# Altium project Remote_Controller.PrjPcb
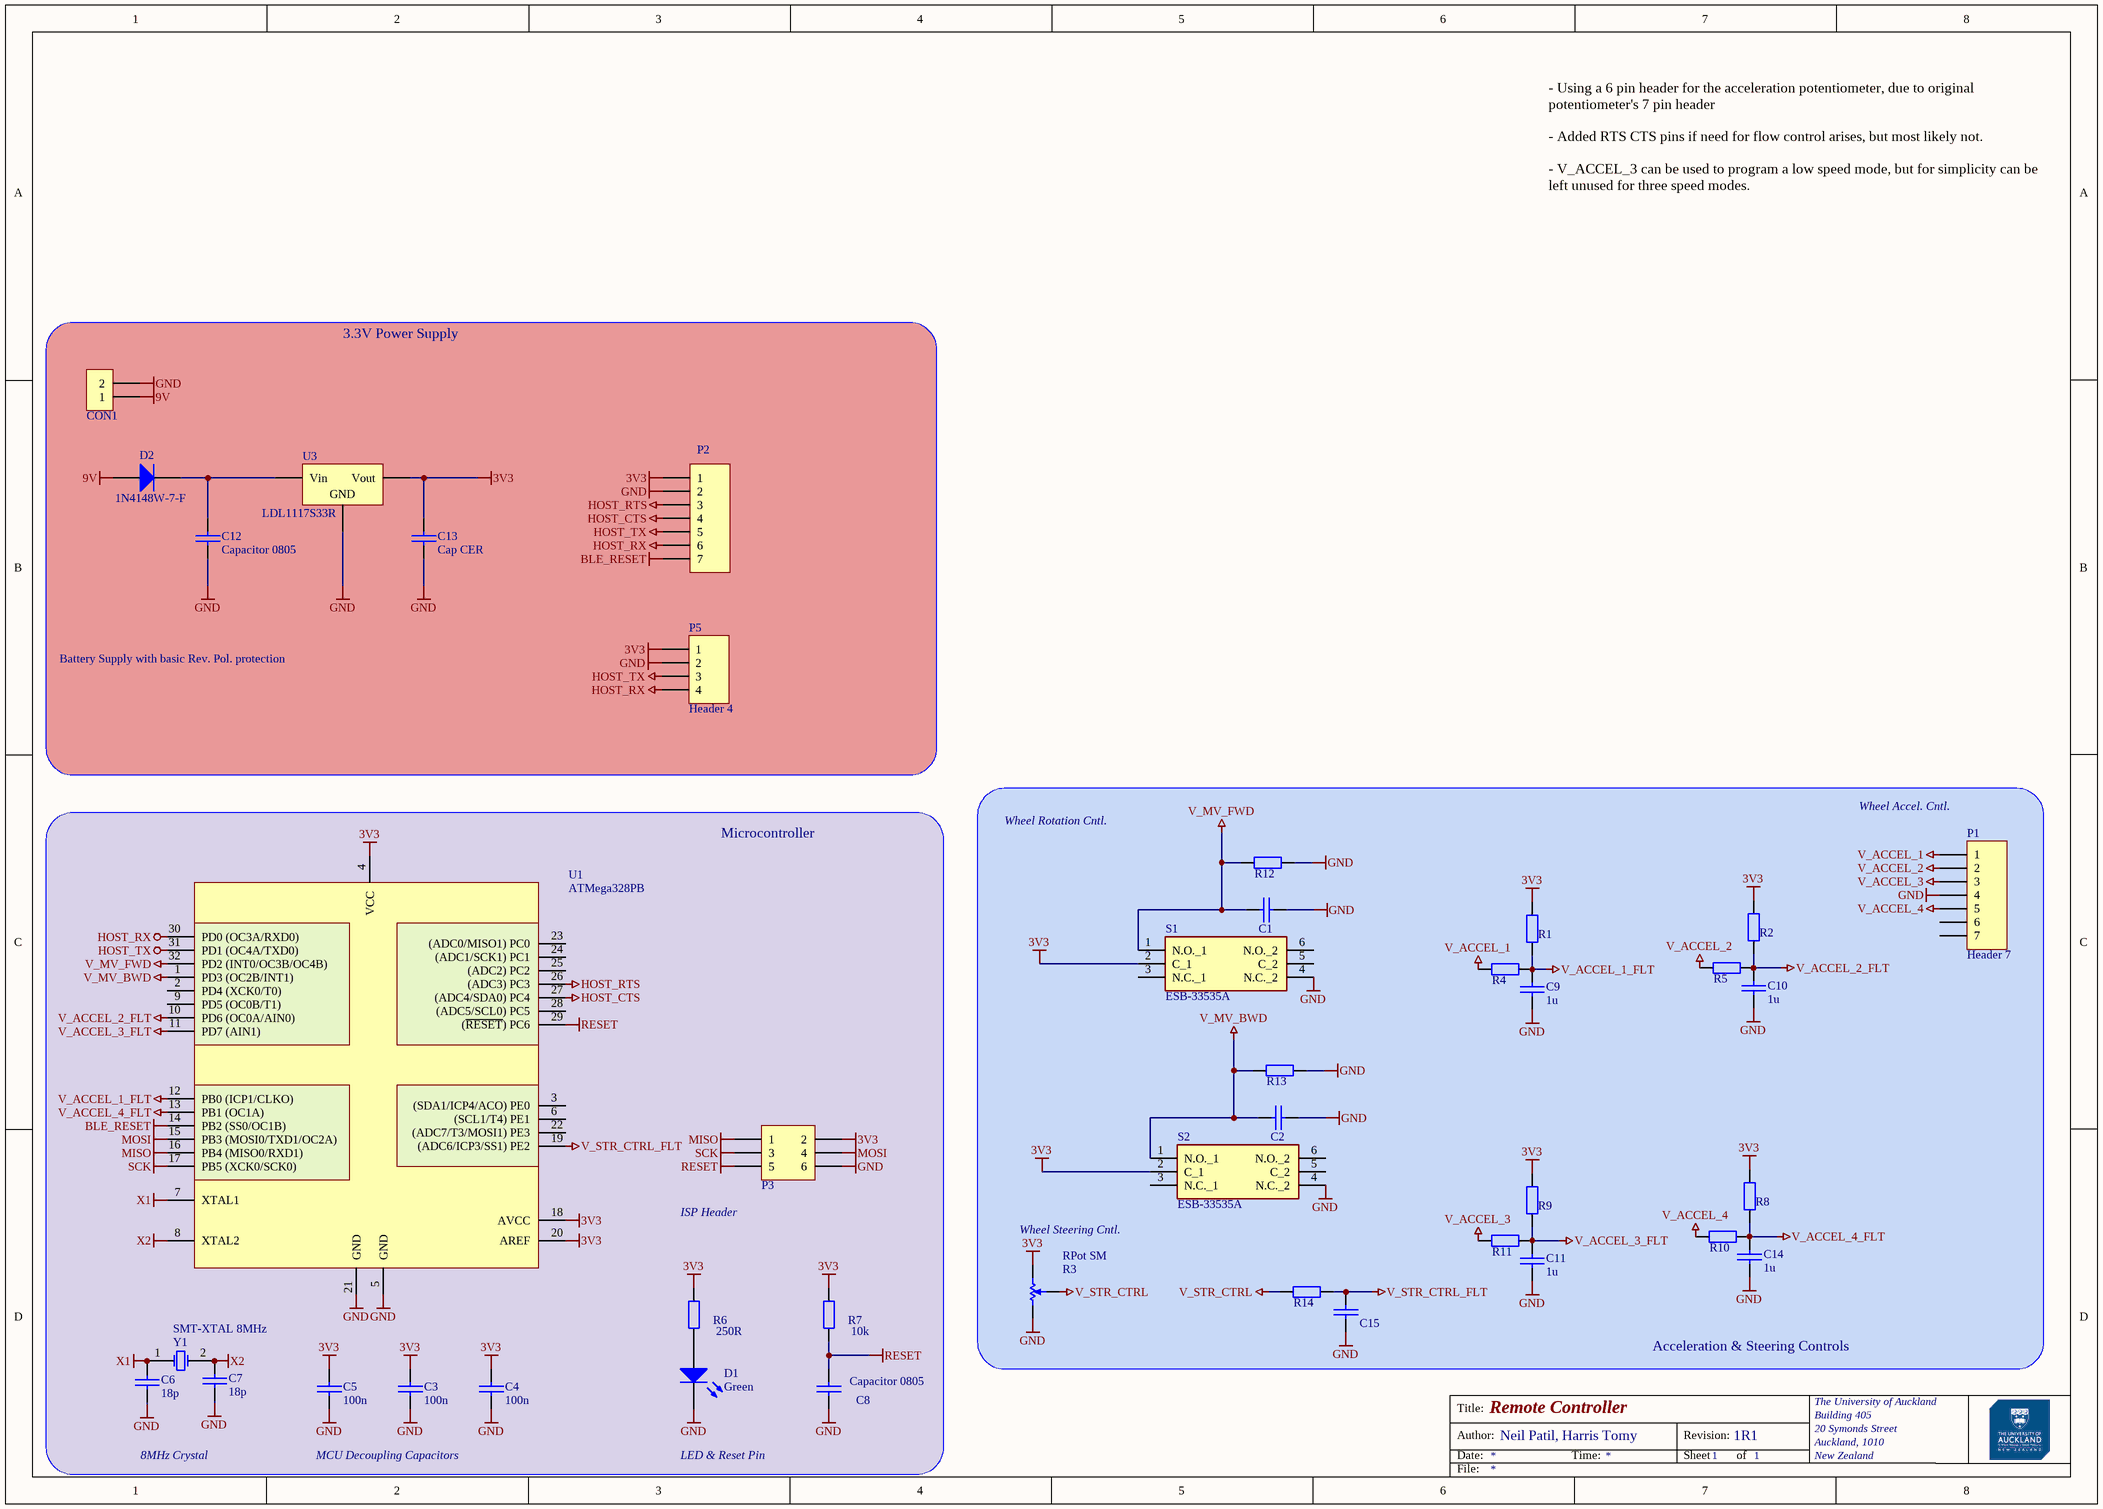
[diagram p0: RemoteSch_1R1.SchDoc]
1 sheet, 41 parts. Net scope: global (net labels, ports and power ports of the same name join across sheets).
Board file: RemoteCntrl_1R3.PcbDoc

## Sheet RemoteSch_1R1.SchDoc: Remote Controller
size A3; Author: Neil Patil, Harris Tomy; Organization: The University of Auckland; Address1: Building 405; Address2: 20 Symonds Street; Address3: Auckland, 1010; Address4: New Zealand; Revision: 1R1; SheetNumber: 1; SheetTotal: 1

### Parts
C1  Capacitor 0805  [C0805]  (value not drawn)
C2  Capacitor 0805  [C0805]  (value not drawn)
C3  100n  [C0805]
C4  100n  [C0805]
C5  100n  [C0805]
C6  18p  [C0805]
C7  18p  [C0805]
C8  Capacitor 0805  [C0805]
C9  1u  [C0805]
C10  1u  [C0805]
C11  1u  [C0805]
C12  Capacitor 0805  [C0805]
C13  Cap CER  [C1206]
C14  1u  [C0805]
C15  Capacitor 0805  [C0805]  (value not drawn)
CON1  Header 2X1  [HDR2X1_2P54]  (value not drawn)
D1  Green  [LED]
D2  1N4148W-7-F  [SOD123]
P1  Header 7  [HDR1X7]
P2  Header 7  [HDR1X7]  (value not drawn)
P3  HDR3X2  [HDR2X3_2P54]  (value not drawn)
P5  Header 4  [HDR1X4]
R1  Resistor 0805  [R0805]  (value not drawn)
R2  Resistor 0805  [R0805]  (value not drawn)
R3  RPot SM  [POT4MM-2]
R4  Resistor 0805  [R0805]  (value not drawn)
R5  Resistor 0805  [R0805]  (value not drawn)
R6  250R  [R0805]
R7  10k  [R0805]
R8  Resistor 0805  [R0805]  (value not drawn)
R9  Resistor 0805  [R0805]  (value not drawn)
R10  Resistor 0805  [R0805]  (value not drawn)
R11  Resistor 0805  [R0805]  (value not drawn)
R12  Resistor 0805  [R0805]  (value not drawn)
R13  Resistor 0805  [R0805]  (value not drawn)
R14  Resistor 0805  [R0805]  (value not drawn)
S1  ESB-33535A  [ESB33535A]
S2  ESB-33535A  [ESB33535A]
U1  ATMega328PB  [TQFP32]
U3  LDL1117S33R  [SOT223L]
Y1  SMT-XTAL 8MHz  [HC49-US]

### Blocks framed on the sheet
3.3V Power Supply: C12 C13 CON1 D2 P2 P5 U3
Microcontroller: C3-C8 D1 P3 R6 R7 U1 Y1
Acceleration & Steering Controls: C1 C2 C9-C11 C14 C15 P1 R1-R5 R8-R14 S1 S2

### Nets
3V3: C3.2 C4.2 C5.2 C13.2 P2.1 P3.2 P5.1 R1.2 R2.2 R3.CW(+) R6.2 R7.2 R8.2 R9.2 S1.2(C_1) S2.2(C_1) U1.4(VCC) U1.18(AVCC) U1.20(AREF) U3.2(Vout)
9V: CON1.1 D2.1(A)
BLE_RESET: P2.7 U1.14(PB2_(SS0/OC1B))
GND: C1.1 C2.1 C3.1 C4.1 C5.1 C6.2 C7.2 C8.1 C9.1 C10.1 C11.1 C12.1 C13.1 C14.1 C15.1 CON1.2 D1.2(K) P1.4 P2.2 P3.6 P5.2 R3.CCW(-) R12.1 R13.1 S1.4(N.C._2) S2.4(N.C._2) U1.5(GND) U1.21(GND) U3.1(GND)
HOST_CTS: P2.4 U1.27((ADC4/SDA0)_PC4)
HOST_RTS: P2.3 U1.26((ADC3)_PC3)
HOST_RX: P2.6 P5.4 U1.30(PD0_(OC3A/RXD0))
HOST_TX: P2.5 P5.3 U1.31(PD1_(OC4A/TXD0))
MISO: P3.1 U1.16(PB4_(MISO0/RXD1))
MOSI: P3.4 U1.15(PB3_(MOSI0/TXD1/OC2A))
RESET: C8.2 P3.5 R7.1 U1.29((~{RESET})_PC6)
SCK: P3.3 U1.17(PB5_(XCK0/SCK0))
V_ACCEL_1: P1.1 R4.2
V_ACCEL_1_FLT: C9.2 R1.1 R4.1 U1.12(PB0_(ICP1/CLKO))
V_ACCEL_2: P1.2 R5.2
V_ACCEL_2_FLT: C10.2 R2.1 R5.1 U1.10(PD6_(OC0A/AIN0))
V_ACCEL_3: P1.3 R11.2
V_ACCEL_3_FLT: C11.2 R9.1 R11.1 U1.11(PD7_(AIN1))
V_ACCEL_4: P1.5 R10.2
V_ACCEL_4_FLT: C14.2 R8.1 R10.1 U1.13(PB1_(OC1A))
V_MV_BWD: C2.2 R13.2 S2.1(N.O._1) U1.1(PD3_(OC2B/INT1))
V_MV_FWD: C1.2 R12.2 S1.1(N.O._1) U1.32(PD2_(INT0/OC3B/OC4B))
V_STR_CTRL: R3.W R14.1
V_STR_CTRL_FLT: C15.2 R14.2 U1.19((ADC6/ICP3/SS1)_PE2)
X1: C6.1 U1.7(XTAL1) Y1.1(OSC1)
X2: C7.1 U1.8(XTAL2) Y1.2(OSC2)
NetC12_2: C12.2 D2.2(K) U3.3(Vin)
NetD1_1: D1.1(A) R6.1

Not connected (* = marked no-connect by the designer): P1 6 7; S1 3(N.C._1) 5(C_2) 6(N.O._2); S2 3(N.C._1) 5(C_2) 6(N.O._2); U1 2(PD4_(XCK0/T0)) 3((SDA1/ICP4/ACO)_PE0) 6((SCL1/T4)_PE1) 9(PD5_(OC0B/T1)) 22((ADC7/T3/MOSI1)_PE3) 23((ADC0/MISO1)_PC0) 24((ADC1/SCK1)_PC1) 25((ADC2)_PC2) 28((ADC5/SCL0)_PC5)

### Notes on the sheet
- - Using a 6 pin header for the acceleration potentiometer, due to original potentiometer's 7 pin header
  - Added RTS CTS pins if need for flow control arises, but most likely not.
  - V_ACCEL_3 can be used to program a low speed mode, but for simplicity can be left unused for three speed modes.
- Battery Supply with basic Rev. Pol. protection
- Wheel Rotation Cntl.
- (near P1) Wheel Accel. Cntl.
- (near P3) ISP Header
- Wheel Steering Cntl.
- 8MHz Crystal
- MCU Decoupling Capacitors
- LED & Reset Pin
- Title:
- Author:
- Date:
- Time:
- Revision:
- Sheet
- of
- File:

### Library data of the parts
C1-C12 C14 C15 = CCAP0805
C13 = Cap CER Decoup C3216C0G2A104J160AC: CAP CER 0.1UF 100V C0G 1206; Manufacturer: TDK Corporation; Type: Surface mount; Value: 100nF/100V; MPN: C3216C0G2A104J160AC; Part Description: CAP CER 0.1UF 100V C0G 1206; Supplier 1: RSComponents; Supplier Part Number 1: 1795799; Supplier 2: Element14; Supplier Part Number 4: 810-C3216C0G2A104J6C; Supplier Part Number 3: 445-172677-1-ND; Supplier Part Number 2: 2906828; Supplier 4: Mouser; Supplier 3: Digi-Key
CON1 = HDR2X1
D1 = LED_TH_2P54: Typical throughole GaAs LED with 2.54mm pitch; Manufacturer: Generic Components; Class I: Optoelectronic; Published: 8-Jun-2000; Revision: July-2002: Re-released for DXP Platform.; Publisher: Altium Limited; Class II: LED; Value: Green
D2 = 1N4148_SMT_SOD123: DIODE GEN PURP 100V 300MA SOD123; Manufacturer: Diodes Incorporated; Manufacturer Part Number: 1N4148W-13-F; Diode Type: Standard; Current - Average Rectified (Io): 150mA; Speed: Small Signal =< 200mA (Io), Any Speed; Capacitance @ Vr, F: 2pF @ 0V, 1MHz; Supplier 1: Digi-Key; RoHS: RoHS Compliant; Category: Discrete Semiconductor Products; Stock 1: 5282; Pricing 1: 1=0.33, 10=0.292, 100=0.1586, 500=0.0976, 1000=0.06656 (NZD); Packaging: Cut Tape (CT); Part Status: Active; Mounting Type: Surface Mount; Package / Case: SOD-123; Supplier Device Package: SOD-123; Operating Temperature - Junction: -65°C ~ 150°C; Base Part Number: 1N4148W; ComponentLink1URL: https://www.diodes.com/assets/Datasheets/ds30086.pdf; ComponentLink1Description: https://www.diodes.com/assets/Datasheets/ds30086.pdf; Supplier Part Number 1: 1N4148W-13FDICT-ND
P1 P2 = Header 7: Header, 7-Pin; LatestRevisionDate: 17-Jul-2002; LatestRevisionNote: Re-released for DXP Platform.; Publisher: Altium Limited
P3 = HDR3X2: Header, 3-Pin, Dual row
P5 = Header 4: Header, 4-Pin; LatestRevisionDate: 17-Jul-2002; LatestRevisionNote: Re-released for DXP Platform.; Publisher: Altium Limited
R1 R2 R4-R14 = RES0805
R3 = RPot SM: Square Trimming Potentiometer; Published: 17-Dec-2003; DatasheetVersion: Oct-2003; PackageReference: POT4MM-2; Publisher: Altium Limited; PackageDescription: Square Trimming Potentiometer; ComponentLink1Description: Manufacturer Link; ComponentLink1URL: http://bourns.com/2/search.html
S1 S2 = ESB-33535A: Switch; Manufacturer_Name: Panasonic; Datasheet Link: https://industrial.panasonic.com/ac/cdn/e/control/switch/push/catalog/sw_pu_eng_esb33.pdf; Height: 12.5mm; Manufacturer_Part_Number: ESB-33535A; Arrow Part Number: ESB-33535A; Arrow Price/Stock: https://www.arrow.com/en/products/esb-33535a/panasonic; Mouser Part Number: 667-ESB-33535A; Mouser Price/Stock: https://www.mouser.co.uk/ProductDetail/Panasonic/ESB-33535A?qs=bhLVwANLX8NKx9UGCqkFcQ%3D%3D
U1 = ATMega328PB: IC MCU 8BIT 32KB FLASH 32TQFP; Supplier 1: Digi-Key; Supplier Part Number 1: ATMEGA328PB-AU-ND; Supplier 2: Digikey; Supplier Part Number 2: ATMEGA328PB-AU-ND
U3 = LDO LDL1117S33R: IC REG LINEAR 3.3V 1.2A SOT223; Manufacturer: STMicroelectronics; Value: 3.3V/1.2A; MPN: LDL1117S33R; Supplier 1: Element14; Type: Surface mount; Part Description: IC REG LINEAR 3.3V 1.2A SOT223; Supplier Part Number 3: 511-LDL1117S33R; Supplier Part Number 2: 497-17239-1-ND; Supplier Part Number 1: 2729708; Supplier 3: Mouser; Supplier 2: Digi-Key
Y1 = TXC9C-16_XTAL_SMT: 9C-16.000MAAJ-T crystal 16.0000MHZ 18PF SMD; Manufacturer: TXC CORPORATION; Frequency Stability: ±30ppm; Operating Mode: Fundamental; Supplier 1: Digi-Key; Manufacturer Part Number: 9C-16.000MAAJ-T; RoHS: RoHS Compliant; Category: Crystals, Oscillators, Resonators; Stock 1: 11514; Pricing 1: 1=0.75, 10=0.628, 50=0.5656, 100=0.5026, 500=0.47744 (NZD); Packaging: Cut Tape (CT); Part Status: Active; Type: MHz Crystal; Frequency Tolerance: ±30ppm; Load Capacitance: 18pF; Operating Temperature: -20°C ~ 70°C; Ratings: -; Mounting Type: Surface Mount; Package / Case: HC-49/US; Size / Dimension: 0.449" L x 0.189" W (11.40mm x 4.80mm); Height - Seated (Max): 0.161" (4.10mm); ComponentLink1URL: http://www.txccorp.com/download/products/quartz_crystals/2015TXC_9C_32.pdf; ComponentLink1Description: http://www.txccorp.com/download/products/quartz_crystals/2015TXC_9C_32.pdf; Supplier Part Number 1: 887-1059-1-ND